# EAGLE design zero_board (EAGLE 6.6.0)
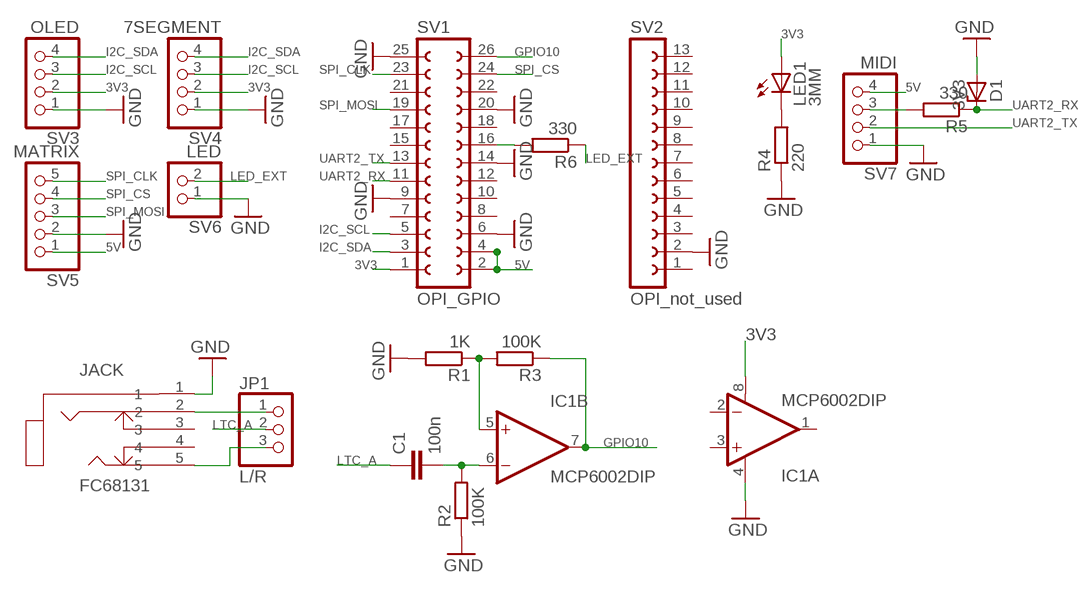
[diagram p0: schematic, sheet 1]

## Parts
C1  100n  C-EU050-024X044  [C050-024X044]
D1  3V3  ZENER-DIODEZD-2.5  [ZDIO-2.5]
IC1  MCP6002DIP  [DIP08]
JACK  FC68131  [FC68131-5P]
JP1  L/R  PINHD-1X3  [1X03]
LED1  3MM  LED3MM  [LED3MM]
R1  1K  R-EU_0204/5  [0204/5]
R2  100K  R-EU_0204/5  [0204/5]
R3  100K  R-EU_0204/5  [0204/5]
R4  220  R-EU_0204/5  [0204/5]
R5  330  R-EU_0204/2V  [0204V]
R6  330  R-EU_0204/2V  [0204V]
SV1  OPI_GPIO  FE13-2  [FE13-2]
SV2  OPI_not_used  FE13-1  [FE13]
SV3  OLED  PINHD-1X4  [1X04]
SV4  7SEGMENT  PINHD-1X4  [1X04]
SV5  MATRIX  PINHD-1X5  [1X05]
SV6  LED  PINHD-1X2  [1X02]
SV7  MIDI  PINHD-1X4  [1X04]

## Nets
3V3: IC1.8(A:V+) LED1.A SV1.1 SV3.2 SV4.2
5V: SV1.2 SV1.4 SV5.1 SV7.4
GND: D1.A IC1.4(A:V-) JACK.1 R1.2 R2.1 R4.1 SV1.6 SV1.9 SV1.14 SV1.20 SV1.25 SV2.2 SV3.1 SV4.1 SV5.2 SV6.1 SV7.1
GPIO10: IC1.7(B:OUT) R3.1 SV1.26
I2C_SCL: SV1.5 SV3.3 SV4.3
I2C_SDA: SV1.3 SV3.4 SV4.4
LED_EXT: R6.1 SV6.2
LTC_A: C1.1 JP1.2
N$1: LED1.K(C) R4.2
N$2: JACK.5 JP1.3
N$3: JACK.2 JP1.1
N$4: R6.2 SV1.16
N$5: C1.2 IC1.6(B:-IN) R2.2
N$6: IC1.5(B:+IN) R1.1 R3.2
N$7: R5.2 SV7.3
SPI_CLK: SV1.23 SV5.5
SPI_CS: SV1.24 SV5.4
SPI_MOSI: SV1.19 SV5.3
UART2_RX: D1.C R5.1 SV1.11
UART2_TX: SV1.13 SV7.2
Unconnected: IC1.1(A:OUT) IC1.2(A:-IN) IC1.3(A:+IN) JACK.3 JACK.4 SV1.7 SV1.8 SV1.10 SV1.12 SV1.15 SV1.17 SV1.18 SV1.21 SV1.22 SV2.1 SV2.3 SV2.4 SV2.5 SV2.6 SV2.7 SV2.8 SV2.9 SV2.10 SV2.11 SV2.12 SV2.13

## Library data of the parts
C1 = rcl:C-EU: CAPACITOR, European symbol
D1 = diode:ZENER-DIODE: Z-Diode
IC1 = MCP6002:MCP6002: 1 MHz, Low-Power Op Amp
JACK = con-cliff:FC68131
JP1 = pinhead:PINHD-1X3: PIN HEADER
LED1 = led:LED: LED OSRAM: - CHIPLED LG R971, LG N971, LY N971, LG Q971, LY Q971, LO R971, LY R971 LH N974, LH R974 LS Q976, LO Q976, LY Q976 LO Q996 - Hyper CHIPLED LW Q18S LB Q993, LB Q99A, LB R99A - SideLED LS A670, LO A670, LY A670, LG A670, LP A670 LB A673, LV A673, LT A673, LW A673 LH A674 LY A675 LS A676, LA A676, LO A676, LY A676, LW A676 LS A679, LY A679, LG A679 - Hyper Micro SIDELED® LS Y876, LA Y876, LO Y876, LY Y876 LT Y87S - SmartLED LW L88C, LW L88S LB L89C, LB L89S, LG L890 LS L89K, LO L89K, LY L89K LS L896, LA L896, LO L896, LY L896 - TOPLED LS T670, LO T670, LY T670, LG T670, LP T670 LSG T670, LSP T670, LSY T670, LOP T670, LYG T670 LG T671, LOG T671, LSG T671 LB T673, LV T673, LT T673, LW T673 LH T674 LS T676, LA T676, LO T676, LY T676, LB T676, LH T676, LSB T676, LW T676 LB T67C, LV T67C, LT T67C, LS T67K, LO T67K, LY T67K, LW E67C LS E67B, LA E67B, LO E67B, LY E67B, LB E67C, LV E67C, LT E67C LW T67C LS T679, LY T679, LG T679 LS T770, LO T770, LY T770, LG T770, LP T770 LB T773, LV T773, LT T773, LW T773 LH T774 LS E675, LA E675, LY E675, LS T675 LS T776, LA T776, LO T776, LY T776, LB T776 LHGB T686 LT T68C, LB T68C - Hyper Mini TOPLED® LB M676 - Mini TOPLED Santana® LG M470 LS M47K, LO M47K, LY M47K Source: http://www.osram.convergy.de LUXEON: - LUMILED® LXK2-PW12-R00, LXK2-PW12-S00, LXK2-PW14-U00, LXK2-PW14-V00 LXK2-PM12-R00, LXK2-PM12-S00, LXK2-PM14-U00 LXK2-PE12-Q00, LXK2-PE12-R00, LXK2-PE12-S00, LXK2-PE14-T00, LXK2-PE14-U00 LXK2-PB12-K00, LXK2-PB12-L00, LXK2-PB12-M00, LXK2-PB14-N00, LXK2-PB14-P00, LXK2-PB14-Q00 LXK2-PR12-L00, LXK2-PR12-M00, LXK2-PR14-Q00, LXK2-PR14-R00 LXK2-PD12-Q00, LXK2-PD12-R00, LXK2-PD12-S00 LXK2-PH12-R00, LXK2-PH12-S00 LXK2-PL12-P00, LXK2-PL12-Q00, LXK2-PL12-R00 Source: www.luxeon.com KINGBRIGHT: KA-3528ASYC Source: www.kingbright.com
R1-R6 = rcl:R-EU_: RESISTOR, European symbol
SV1 = con-lsta:FE13-2: FEMALE HEADER; OC_FARNELL: unknown; OC_NEWARK: unknown
SV2 = con-lsta:FE13-1: FEMALE HEADER; OC_FARNELL: unknown; OC_NEWARK: unknown
SV3 SV4 SV7 = pinhead:PINHD-1X4: PIN HEADER
SV5 = pinhead:PINHD-1X5: PIN HEADER
SV6 = pinhead:PINHD-1X2: PIN HEADER

## Board
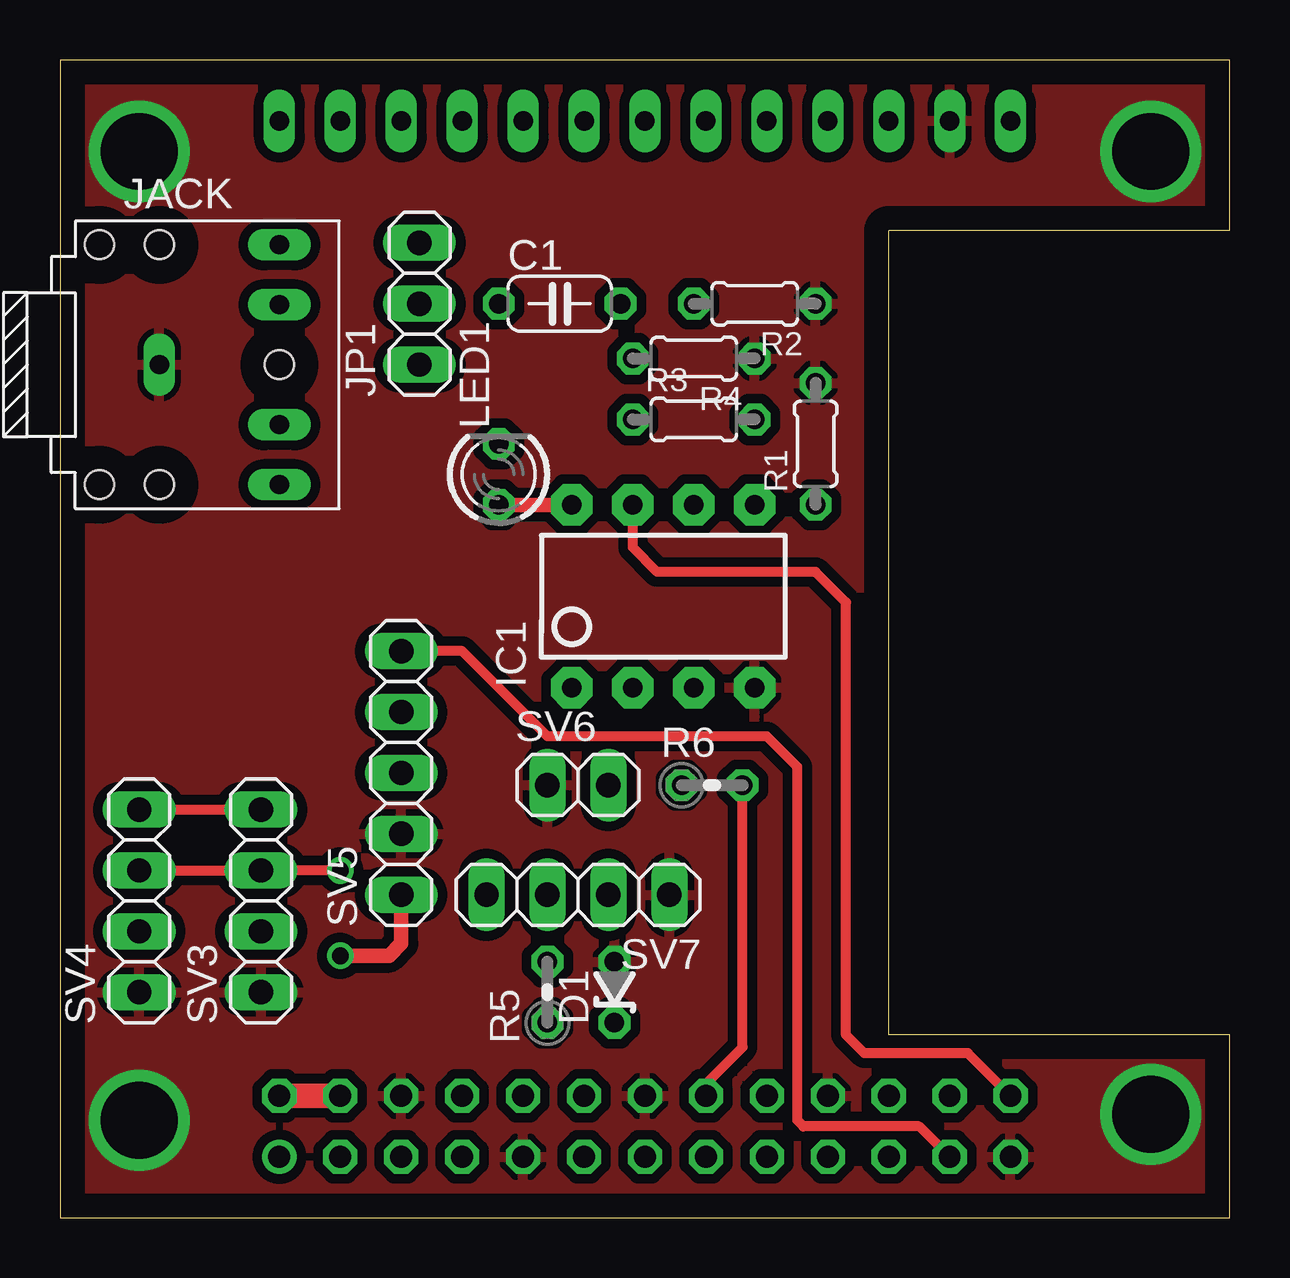
[diagram p1: board, top side]
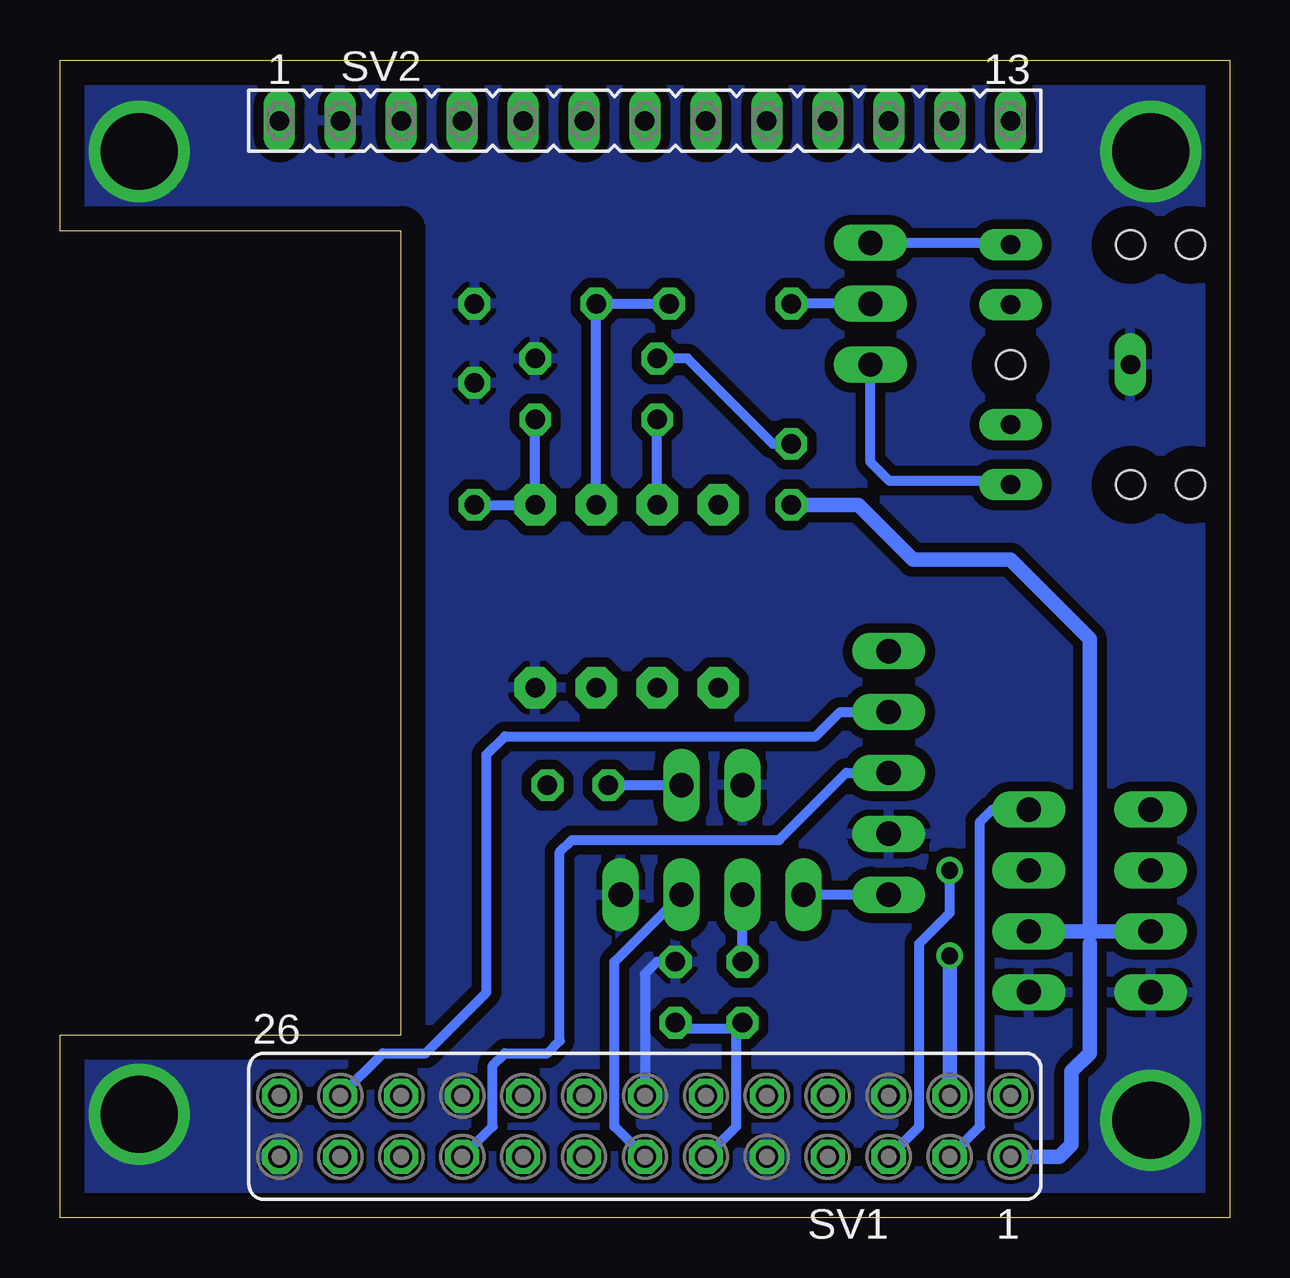
[diagram p2: board, bottom side, seen from below]

Size 48.77 x 48.26 mm. Coordinates in mm from the lower left corner, seen from the top.
Outline: 0,48.25 0,0 48.77,0 48.77,7.62 34.54,7.62 34.54,41.15 48.77,41.15 48.77,48.26 0,48.26
Copper layers (1*16): Top 0.035mm / dielectric 1.5mm / Bottom 0.035mm
Design rules "default": minimum track width 10mil, minimum drill 24mil, track to track 8mil, track to pad 8mil, pad to pad 8mil, via to via 8mil, smd to smd 8mil, copper to edge 40mil, drill to drill 8mil, minimum pad ring 10mil, minimum via ring 8mil, stop-mask expansion 4mil, vias tented up to drill 0mil, thermal gap 10mil

### Footprints (pad centres in the part's own frame; a part is rotated, then mirrored left to right if it is on the bottom)
C050-024X044 = drill 0.813 octagon: 1 -2.54,0; 2 2.54,0
ZDIO-2.5 = drill 0.813 octagon: A 1.27,0; C -1.27,0
DIP08 = drill 0.813 pad 1.727 octagon: 1 -3.81,-3.81; 2 -1.27,-3.81; 3 1.27,-3.81; 4 3.81,-3.81; 5 3.81,3.81; 6 1.27,3.81; 7 -1.27,3.81; 8 -3.81,3.81
FC68131-5P = drill 0.8 long: 1 -5,0; 2 0,-5; 3 0,-2.5; 4 0,2.5; 5 0,5 | hole 1.2: 0,0; -5,-5; -5,5; -7.5,5; -7.5,-5
1X03 = drill 1.016 long: 1 -2.54,0; 2 0,0; 3 2.54,0
LED3MM = drill 0.813 octagon: A -1.27,0; K 1.27,0
0204/5 = drill 0.813 octagon: 1 -2.54,0; 2 2.54,0
0204V = drill 0.813 octagon: 1 -1.27,0; 2 1.27,0
FE13-2 = drill 0.914: 1 -15.24,1.27 | drill 0.914 octagon: 2 -15.24,-1.27; 3 -12.7,1.27; 4 -12.7,-1.27; 5 -10.16,1.27; 6 -10.16,-1.27; 7 -7.62,1.27; 8 -7.62,-1.27; 9 -5.08,1.27; 10 -5.08,-1.27; 11 -2.54,1.27; 12 -2.54,-1.27; 13 0,1.27; 14 0,-1.27; 15 2.54,1.27; 16 2.54,-1.27; 17 5.08,1.27; 18 5.08,-1.27; 19 7.62,1.27; 20 7.62,-1.27; 21 10.16,1.27; 22 10.16,-1.27; 23 12.7,1.27; 24 12.7,-1.27; 25 15.24,1.27; 26 15.24,-1.27
FE13 = drill 0.813 long: 1 -15.24,0; 2 -12.7,0; 3 -10.16,0; 4 -7.62,0; 5 -5.08,0; 6 -2.54,0; 7 0,0; 8 2.54,0; 9 5.08,0; 10 7.62,0; 11 10.16,0; 12 12.7,0; 13 15.24,0
1X04 = drill 1.016 long: 1 -3.81,0; 2 -1.27,0; 3 1.27,0; 4 3.81,0
1X05 = drill 1.016 long: 1 -5.08,0; 2 -2.54,0; 3 0,0; 4 2.54,0; 5 5.08,0
1X02 = drill 1.016 long: 1 -1.27,0; 2 1.27,0

### Placement (x,y rotation side)
C1  20.83,38.1 0 top
D1  23.11,9.4 90 top
IC1  25.15,25.91 0 top
JACK  9.14,35.56 0 top
JP1  14.99,38.1 90 top
LED1  18.29,30.99 90 top
R1  31.5,32.26 90 top
R2  28.96,38.1 180 top
R3  26.42,33.27 0 top
R4  26.42,35.81 180 top
R5  20.32,9.4 90 top
R6  27.18,18.03 0 top
SV1  24.38,3.81 180 bottom
SV2  24.38,45.72 0 bottom
SV3  8.38,13.21 90 top
SV4  3.3,13.21 90 top
SV5  14.22,18.54 90 top
SV6  21.59,18.03 0 top
SV7  21.59,13.46 180 top

### Tracks (layer width: path | path; a pad name or v marks a point on that pad's centre or on a via)
3V3
  Top 0.61: IC1.8 LED1.A
  Bottom 0.406: 5.84,11.43 5.84,11.94
  Bottom 0.61: SV4.2 5.84,11.94 | 5.84,11.94 SV3.2 | SV1.1 7.11,2.54 6.6,3.05 6.6,6.1 5.84,6.86 5.84,11.43 | LED1.A 15.49,29.72 13.21,27.43 9.14,27.43 5.84,24.13 5.84,11.94
5V  (via drill 0.7)
  Top 0.61: v11.68,10.92 13.72,10.92 14.22,11.43 SV5.1
  Top 1.016: SV1.4 SV1.2
  Bottom 0.406: SV5.1 SV7.4
  Bottom 0.61: SV1.4 v11.68,10.92
GND  (via drill 3.2)
  Bottom 0.406: JACK.1 4.14,35.64 | D1.A 23.88,10.67 24.38,10.16 SV1.14
  other vias: 3.3,4.06 45.47,4.32 3.3,44.45 45.47,44.45
  pour Bottom (isolate 0.406): 48.77,-1.78 0,-1.78 0,48.51 48.77,48.51 48.77,41.15 34.54,41.15 34.54,7.62 48.77,7.62
  pour Top (isolate 0.406): 48.26,-2.03 48.77,7.62 34.54,7.62 34.54,41.15 48.77,41.15 48.77,48.51 0,48.51 -0.51,-2.03
GPIO10
  Top 0.406: SV1.26 37.85,6.86 33.53,6.86 32.77,7.62 32.77,25.65 31.5,26.92 24.89,26.92 23.88,27.94 IC1.7
  Bottom 0.406: IC1.7 R3.1
I2C_SCL  (via drill 0.7)
  Top 0.406: SV4.3 SV3.3 v11.68,14.48
  Bottom 0.406: SV1.5 12.95,3.81 12.95,11.43 11.68,12.7 v11.68,14.48
I2C_SDA
  Top 0.406: SV4.4 SV3.4
  Bottom 0.406: SV1.3 10.41,3.81 10.41,16.51 9.91,17.02 SV3.4
LED_EXT
  Bottom 0.406: R6.1 SV6.2
LTC_A
  Bottom 0.406: JP1.2 C1.1
N$1
  Bottom 0.406: LED1.K 19.05,32.26 22.61,35.81 R4.2
N$2
  Bottom 0.406: JP1.3 9.22,40.64 JACK.5
N$3
  Bottom 0.406: JACK.2 9.32,30.73 14.22,30.73 14.99,31.5 JP1.1
N$4
  Top 0.406: SV1.16 26.92,5.59 28.45,7.11 R6.2
N$5
  Bottom 0.406: C1.2 R2.2 IC1.6
N$6
  Bottom 0.406: R1.1 IC1.5 R3.2
N$7
  Bottom 0.406: R5.2 SV7.3
SPI_CLK
  Top 0.406: SV1.23 35.81,3.81 30.99,3.81 30.73,4.06 30.73,18.8 29.46,20.07 20.32,20.07 16.76,23.62 SV5.5
SPI_CS
  Bottom 0.406: SV1.24 35.31,6.86 33.53,6.86 30.99,9.4 30.99,19.3 30.23,20.07 17.27,20.07 16.26,21.08 SV5.4
SPI_MOSI
  Bottom 0.406: SV1.19 30.73,3.81 30.73,6.35 30.23,6.86 28.45,6.86 27.94,7.37 27.94,15.24 27.43,15.75 18.8,15.75 16,18.54 SV5.3
UART2_RX
  Bottom 0.406: SV1.11 20.57,3.81 20.57,7.87 | 20.57,7.87 R5.1 | 20.57,7.87 22.86,7.87 D1.C
UART2_TX
  Bottom 0.406: SV1.13 25.65,3.81 25.65,10.67 SV7.2